# EAGLE design SparkFun_MicroMod_Input_and_Display_Carrier (EAGLE 9.6.2)

## Sheet 1 of 2
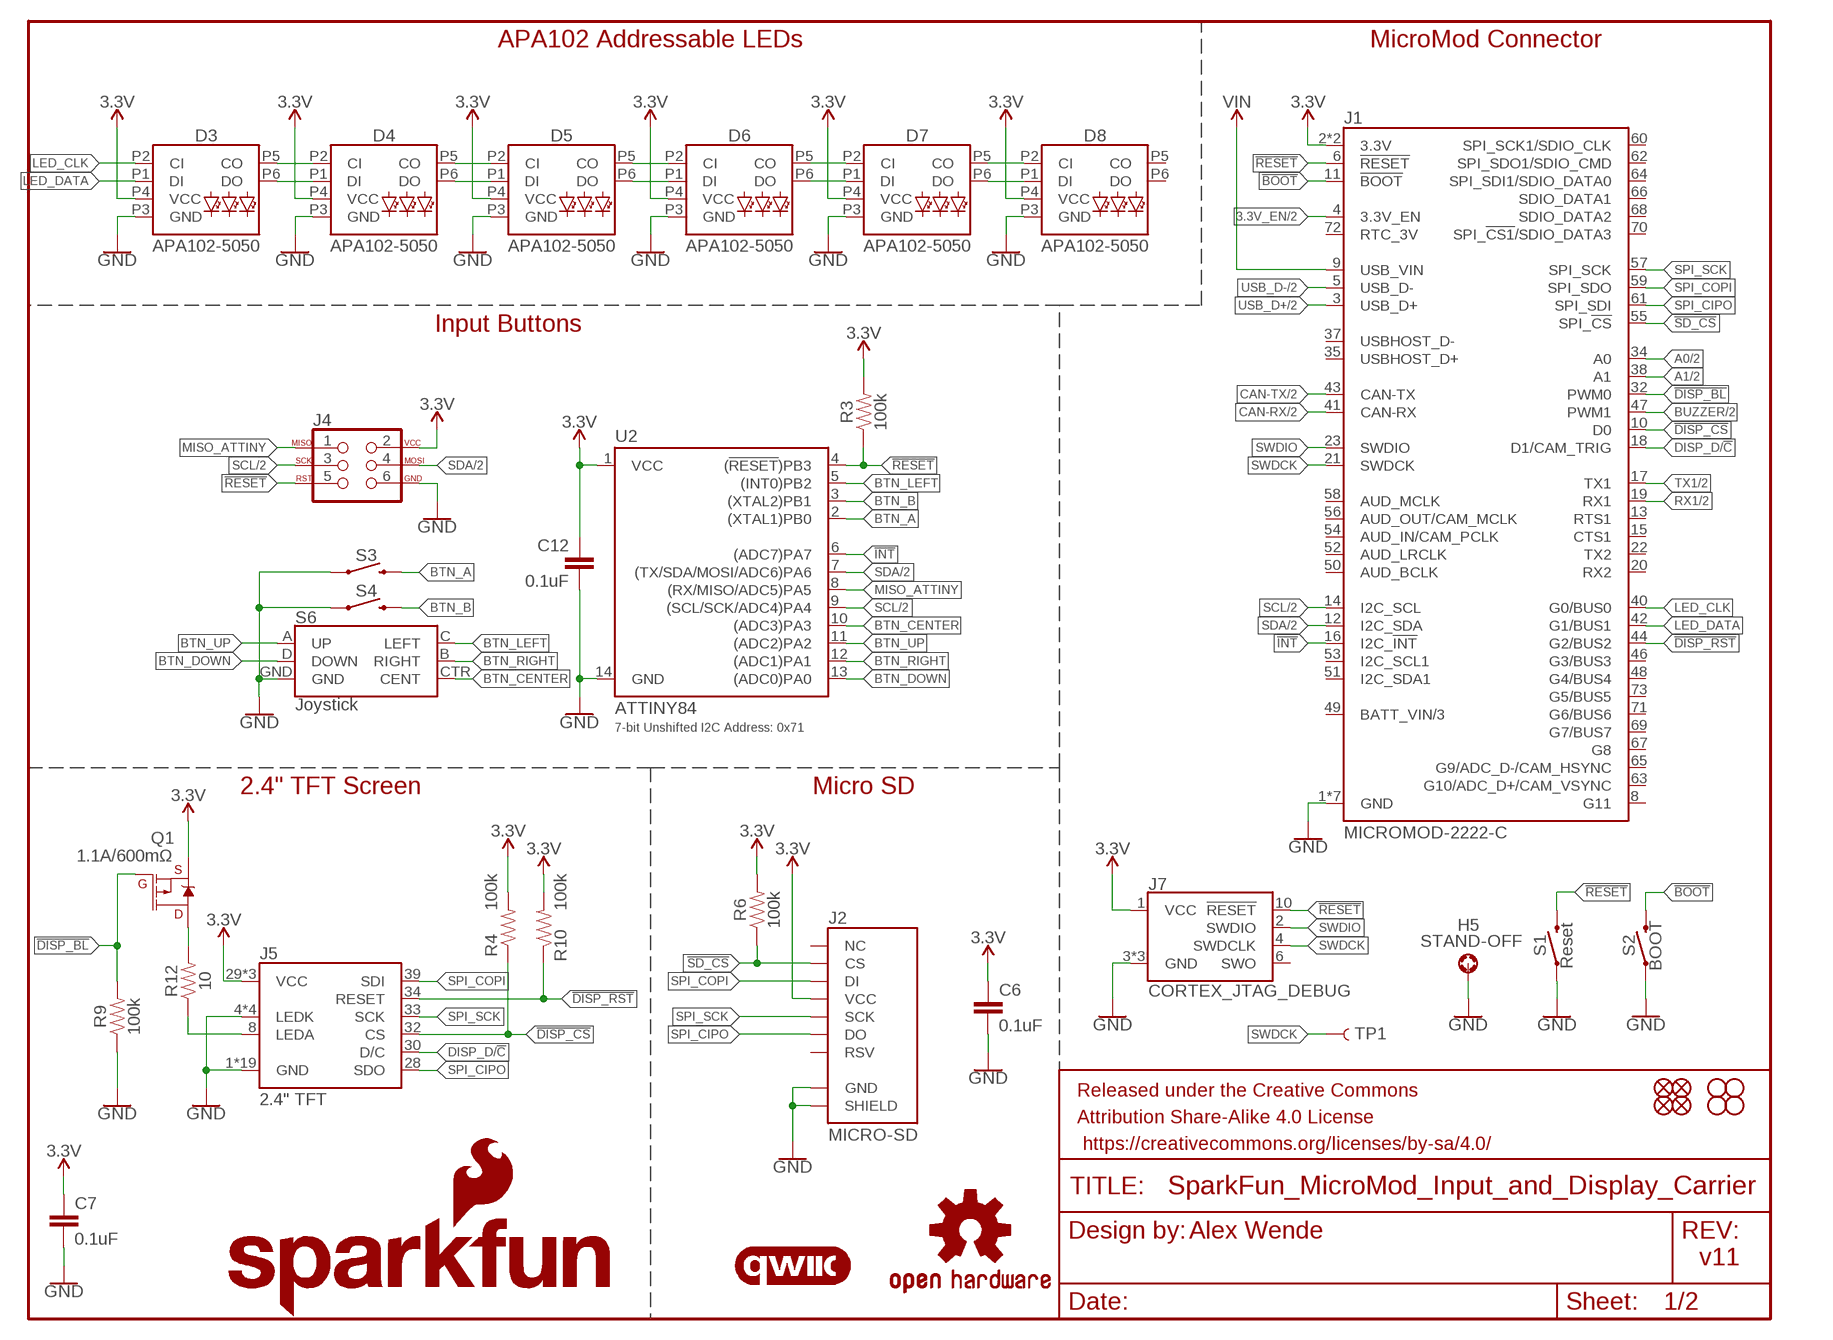
[diagram p0: schematic, sheet 1]

### Parts
C6  0.1uF  0.1UF-0603-25V-(+80/-20%)  [0603]
C7  0.1uF  0.1UF-0603-25V-(+80/-20%)  [0603]
C12  0.1uF  0.1UF-0603-25V-(+80/-20%)  [0603]
D3  APA102-5050  [APA102-5050]
D4  APA102-5050  [APA102-5050]
D5  APA102-5050  [APA102-5050]
D6  APA102-5050  [APA102-5050]
D7  APA102-5050  [APA102-5050]
D8  APA102-5050  [APA102-5050]
FD1  FIDUCIALUFIDUCIAL  [FIDUCIAL-MICRO]
FD2  FIDUCIALUFIDUCIAL  [FIDUCIAL-MICRO]
FD3  FIDUCIALUFIDUCIAL  [FIDUCIAL-MICRO]
FD4  FIDUCIALUFIDUCIAL  [FIDUCIAL-MICRO]
FRAME1  FRAME-LETTER  [CREATIVE_COMMONS]
H1  STAND-OFF  [STAND-OFF]
H2  STAND-OFF  [STAND-OFF]
H3  STAND-OFF  [STAND-OFF]
H4  STAND-OFF  [STAND-OFF]
H5  STAND-OFF  STAND-OFF-REFLOW2.5MM_TALL  [STAND-OFF-REFLOW-M2.5]
J1  MICROMOD-2222-C  [M.2-CONNECTOR-E]
J2  MICRO-SD  MICRO-SD-SPIPUSH-PUSH  [MICRO-SD-SOCKET]
J4  AVR_SPI_PROG_3X2TESTPOINTS  [2X3_TEST_POINTS]
J5  2.4" TFT  4DLCD-24-320X240  [FPC05040-17204]
J7  CORTEX_JTAG_DEBUG  CORTEX_JTAG_DEBUG_MINIMUM_PTH_NS  [2X5-PTH-1.27MM-NO_SILK]
LOGO1  SFE_LOGO_NAME_FLAME.2_INCH  [SFE_LOGO_NAME_FLAME_.2]
LOGO2  QWIIC_LOGO_5MM  [QWIIC_5MM]
LOGO3  OSHW-LOGOS  [OSHW-LOGO-S]
Q1  1.1A/600mΩ  MOSFET_PCH-SI2309DS  [SOT23-3]
R3  100k  100KOHM-0603-1/10W-1%  [0603]
R4  100k  100KOHM-0603-1/10W-1%  [0603]
R6  100k  100KOHM-0603-1/10W-1%  [0603]
R9  100k  100KOHM-0603-1/10W-1%  [0603]
R10  100k  100KOHM-0603-1/10W-1%  [0603]
R12  10  10OHM-1206-1/4W-1%  [1206]
S1  Reset  MOMENTARY-SWITCH-SPST-SMD-5.2-TALL-REDUNDANT  [TACTILE_SWITCH_SMD_5.2MM]
S2  BOOT  MOMENTARY-SWITCH-SPST-SMD-5.2-TALL-REDUNDANT  [TACTILE_SWITCH_SMD_5.2MM]
S3  MOMENTARY-SWITCH-SPST-SMD-5.2MM-TALL  [TACTILE_SWITCH_SMD_5.2MM]
S4  MOMENTARY-SWITCH-SPST-SMD-5.2MM-TALL  [TACTILE_SWITCH_SMD_5.2MM]
S6  Joystick  JOYSTICK_MINI  [JOYSTICK_MINI]
TP1  TEST-POINT3  [PAD.03X.03]
U2  ATTINY84  [SO14]

### Nets
3.3V: C6.1 C7.1 C12.1 D3.P4(VCC) D4.P4(VCC) D5.P4(VCC) D6.P4(VCC) D7.P4(VCC) D8.P4(VCC) J1.2(3.3V) J1.74(3.3V) J2.VCC J4.2 J5.29(VCC) J5.31(VCC) J5.38(VCC) J7.1(VCC) Q1.2(S) R3.2 R4.2 R6.2 R10.2 U2.1(VCC) ; also sheet 2
3.3V_EN: J1.4(3.3V_EN) ; also sheet 2
!BOOT: J1.11(!BOOT!) S2.3 S2.4
!DISP_BL: J1.32(PWM0) Q1.1(G) R9.2
!DISP_CS: J1.10(D0) J5.32(CS) R4.1
!DISP_RST: J1.44(G2/BUS2) J5.34(RESET) R10.1
!INT: J1.16(I2C_!INT!) U2.6((ADC7)PA7)
!RESET: J1.6(!RESET!) J4.5 J7.10(!RESET) R3.1 S1.3 S1.4 U2.4((!RESET!)PB3)
!SD_CS: J1.55(SPI_!CS!) J2.CS R6.1
A0: J1.34(A0) ; also sheet 2
A1: J1.38(A1) ; also sheet 2
BTN_A: S3.3 U2.2((XTAL1)PB0)
BTN_B: S4.3 U2.3((XTAL2)PB1)
BTN_CENTER: S6.CTR(CENT) U2.10((ADC3)PA3)
BTN_DOWN: S6.D(DOWN) U2.13((ADC0)PA0)
BTN_LEFT: S6.C(LEFT) U2.5((INT0)PB2)
BTN_RIGHT: S6.B(RIGHT) U2.12((ADC1)PA1)
BTN_UP: S6.A(UP) U2.11((ADC2)PA2)
BUZZER: J1.47(PWM1) ; also sheet 2
CAN-RX: J1.41(CAN-RX) ; also sheet 2
CAN-TX: J1.43(CAN-TX) ; also sheet 2
DISP_D/!C: J1.18(D1/CAM_TRIG) J5.30(D/C)
GND: C6.2 C7.2 C12.2 D3.P3(GND) D4.P3(GND) D5.P3(GND) D6.P3(GND) D7.P3(GND) D8.P3(GND) H5.1 J1.1(GND) J1.7(GND) J1.33(GND) J1.36(GND) J1.39(GND) J1.45(GND) J1.75(GND) J2.CD1(SHIELD) J2.GND J4.6 J5.1(GND) J5.4(LEDK) J5.5(LEDK) J5.6(LEDK) J5.7(LEDK) J5.11(GND) J5.12(GND) J5.13(GND) J5.14(GND) J5.15(GND) J5.16(GND) J5.17(GND) J5.18(GND) J5.19(GND) J5.20(GND) J5.21(GND) J5.22(GND) J5.23(GND) J5.24(GND) J5.25(GND) J5.26(GND) J5.27(GND) J5.40(GND) J7.3(GND) J7.5(GND) J7.9(GND) R9.1 S1.1 S1.2 S2.1 S2.2 S3.1 S4.1 S6.GND U2.14(GND) ; also sheet 2
LED_CLK: D3.P2(CI) J1.40(G0/BUS0)
LED_DATA: D3.P1(DI) J1.42(G1/BUS1)
MISO_ATTINY: J4.1 U2.8((RX/MISO/ADC5)PA5)
N$3: J5.8(LEDA) R12.1
N$4: Q1.3(D) R12.2
N$11: D3.P5(CO) D4.P2(CI)
N$14: D3.P6(DO) D4.P1(DI)
N$24: D4.P5(CO) D5.P2(CI)
N$25: D4.P6(DO) D5.P1(DI)
N$26: D5.P5(CO) D6.P2(CI)
N$27: D5.P6(DO) D6.P1(DI)
N$28: D6.P5(CO) D7.P2(CI)
N$29: D6.P6(DO) D7.P1(DI)
N$30: D7.P5(CO) D8.P2(CI)
N$31: D7.P6(DO) D8.P1(DI)
RX1: J1.19(RX1) ; also sheet 2
SCL: J1.14(I2C_SCL) J4.3 U2.9((SCL/SCK/ADC4)PA4) ; also sheet 2
SDA: J1.12(I2C_SDA) J4.4 U2.7((TX/SDA/MOSI/ADC6)PA6) ; also sheet 2
SPI_CIPO: J1.61(SPI_SDI) J2.DO J5.28(SDO)
SPI_COPI: J1.59(SPI_SDO) J2.DI J5.39(SDI)
SPI_SCK: J1.57(SPI_SCK) J2.SCLK(SCK) J5.33(SCK)
SWDCK: J1.21(SWDCK) J7.4(SWDCLK) TP1.P$1
SWDIO: J1.23(SWDIO) J7.2(SWDIO)
TX1: J1.17(TX1) ; also sheet 2
USB_D+: J1.3(USB_D+) ; also sheet 2
USB_D-: J1.5(USB_D-) ; also sheet 2
VIN: J1.9(USB_VIN) ; also sheet 2
Unconnected: D8.P5(CO) D8.P6(DO) J1.8(G11) J1.13(RTS1) J1.15(CTS1) J1.20(RX2) J1.22(TX2) J1.35(USBHOST_D+) J1.37(USBHOST_D-) J1.46(G3/BUS3) J1.48(G4/BUS4) J1.49(BATT_VIN/3) J1.50(AUD_BCLK) J1.51(I2C_SDA1) J1.52(AUD_LRCLK) J1.53(I2C_SCL1) J1.54(AUD_IN/CAM_PCLK) J1.56(AUD_OUT/CAM_MCLK) J1.58(AUD_MCLK) J1.60(SPI_SCK1/SDIO_CLK) J1.62(SPI_SDO1/SDIO_CMD) J1.63(G10/ADC_D+/CAM_VSYNC) J1.64(SPI_SDI1/SDIO_DATA0) J1.65(G9/ADC_D-/CAM_HSYNC) J1.66(SDIO_DATA1) J1.67(G8) J1.68(SDIO_DATA2) J1.69(G7/BUS7) J1.70(SPI_!CS1!/SDIO_DATA3) J1.71(G6/BUS6) J1.72(RTC_3V) J1.73(G5/BUS5) J2.RSV1(RSV) J2.RSV2(NC) J7.6(SWO)

### Notes on the sheet
- APA102 Addressable LEDs | MicroMod Connector
- Input Buttons
- 7-bit Unshifted I2C Address: 0x71
- 2.4" TFT Screen | Micro SD
- Alex Wende
- v11

## Sheet 2 of 2
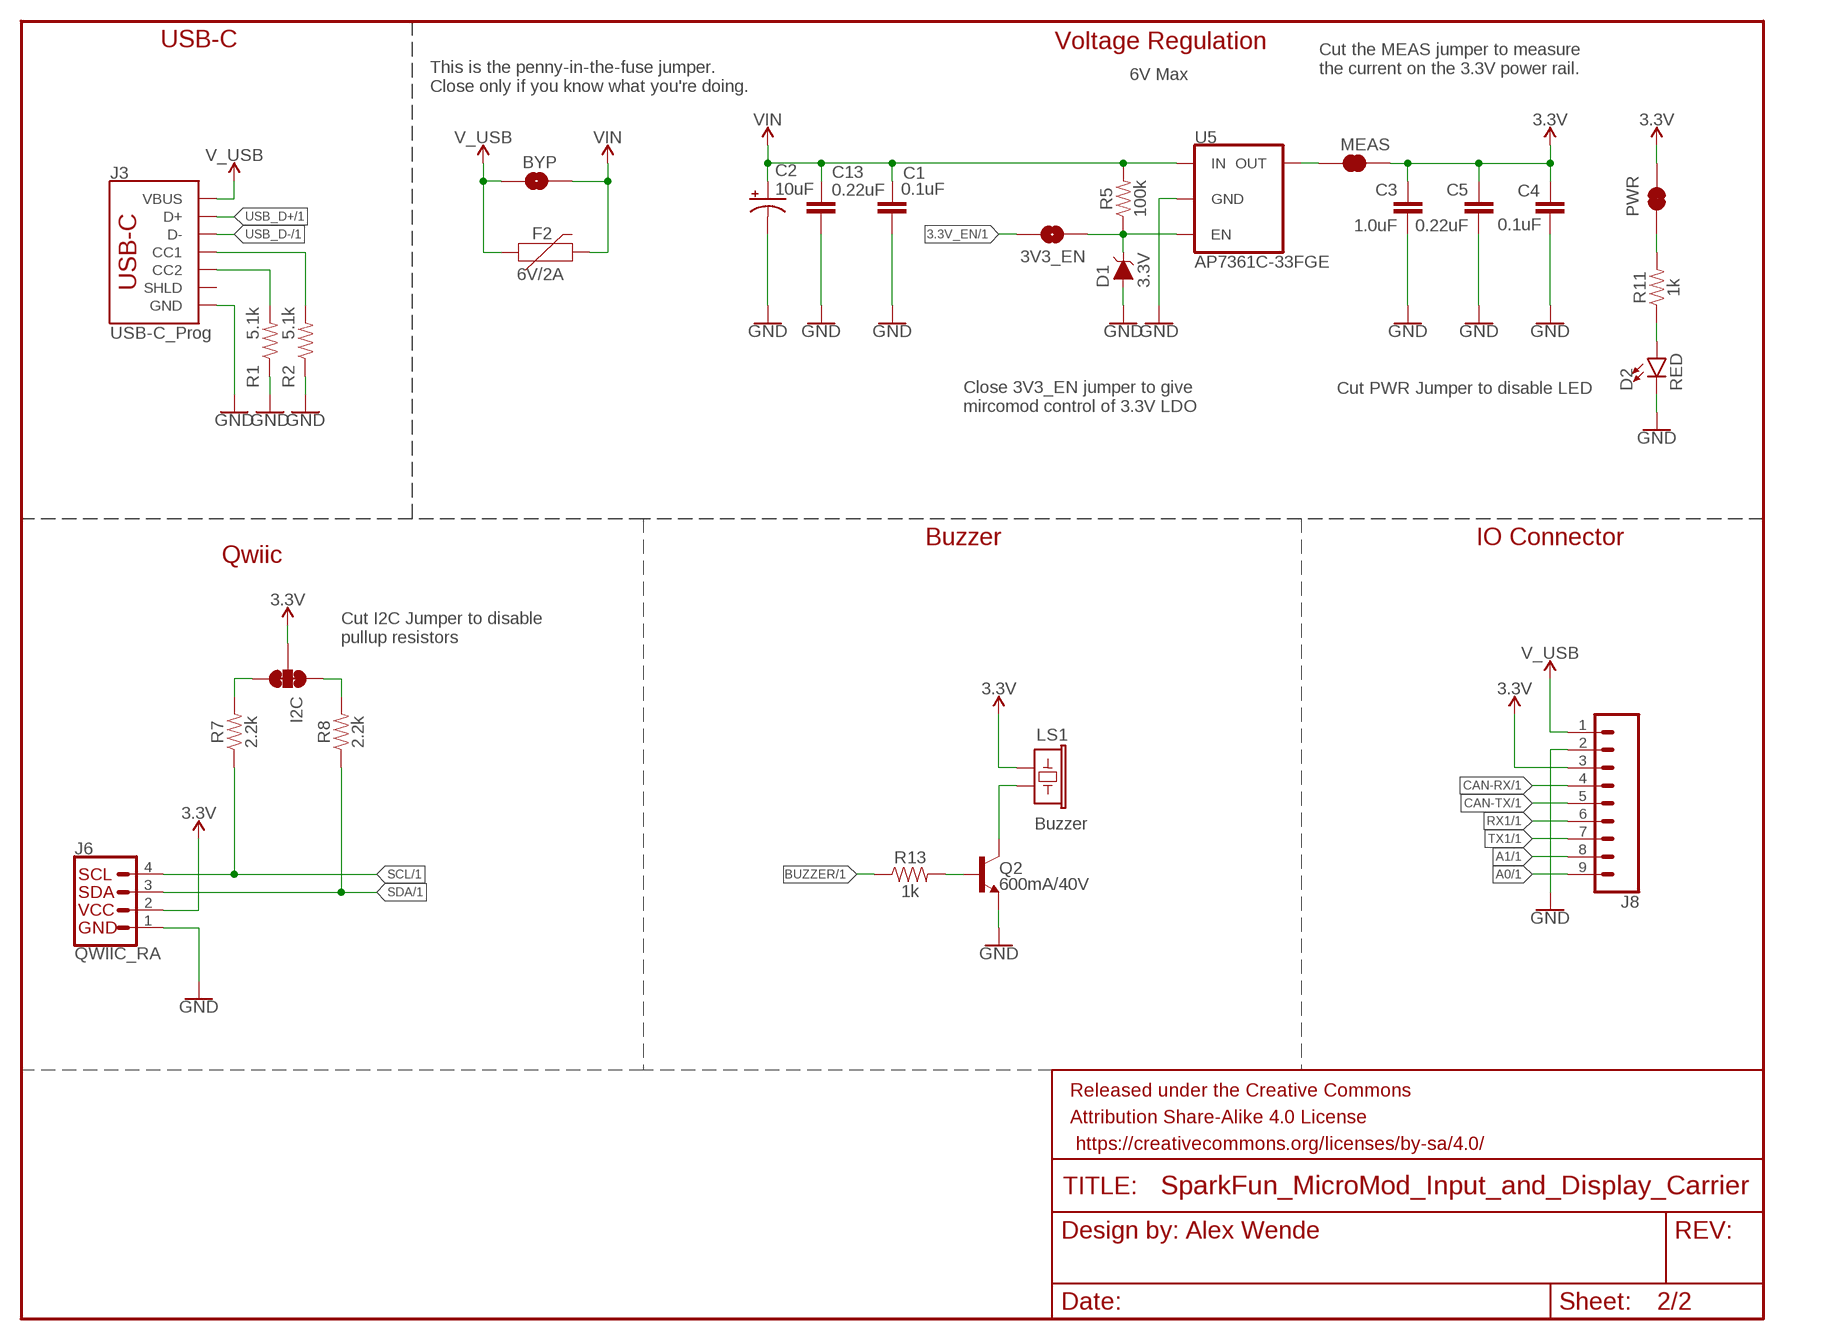
[diagram p1: schematic, sheet 2]

### Parts
3V3_EN  JUMPER-SMT_2_NO_SILK  [SMT-JUMPER_2_NO_SILK]
BYP  JUMPER-SMT_2_NO_SILK  [SMT-JUMPER_2_NO_SILK]
C1  0.1uF  0.1UF-0603-25V-(+80/-20%)  [0603]
C2  10uF  10UF-POLAR-EIA3216-16V-10%(TANT)  [EIA3216]
C3  1.0uF  1.0UF-0603-16V-10%  [0603]
C4  0.1uF  0.1UF-0603-25V-(+80/-20%)  [0603]
C5  0.22uF  0.22UF-0603-25V-10%  [0603]
C13  0.22uF  0.22UF-0603-25V-10%  [0603]
D1  3.3V  DIODE-ZENER-MM3Z3V3T1G  [SOD-323]
D2  RED  LED-RED0603  [LED-0603]
F2  6V/2A  PPTC_6V2A  [1210]
FRAME2  FRAME-LETTERNO_PACKAGE  [DUMMY]
I2C  JUMPER-SMT_3_2-NC_TRACE_SILK  [SMT-JUMPER_3_2-NC_TRACE_SILK]
J3  USB-C_Prog  USB_C_2-LAYER_PADS  [USB-C-16P-2LAYER-PADS]
J6  QWIIC_RA  QWIIC_CONNECTORJS-1MM  [JST04_1MM_RA]
J8  CONN_09NO_SILK  [1X09_NO_SILK]
LS1  Buzzer  BUZZER-SMD  [BUZZER-CCV]
MEAS  JUMPER-COMBO_2_NC_TRACE  [COMBO-JUMPER_2_NC_TRACE]
PWR  JUMPER-SMT_2_NC_TRACE_SILK  [SMT-JUMPER_2_NC_TRACE_SILK]
Q2  600mA/40V  TRANS_NPN-MMBT2222AL  [SOT23-3]
R1  5.1k  5.1KOHM5.1KOHM-0603-1/10W-1%  [0603]
R2  5.1k  5.1KOHM5.1KOHM-0603-1/10W-1%  [0603]
R5  100k  100KOHM-0603-1/10W-1%  [0603]
R7  2.2k  2.2KOHM-0603-1/10W-1%  [0603]
R8  2.2k  2.2KOHM-0603-1/10W-1%  [0603]
R11  1k  1KOHM-0603-1/10W-1%  [0603]
R13  1k  1KOHM-0603-1/10W-1%  [0603]
U5  AP7361C-33FGE  AP7361C-33FGEUDFN-8  [UDFN-8]

### Nets
3.3V: C3.1 C4.1 C5.1 I2C.2 J6.2 J8.3 LS1.+ MEAS.2 MEAS.4 PWR.2 ; also sheet 1
3.3V_EN: 3V3_EN.1 ; also sheet 1
A0: J8.9 ; also sheet 1
A1: J8.8 ; also sheet 1
BUZZER: R13.1 ; also sheet 1
CAN-RX: J8.4 ; also sheet 1
CAN-TX: J8.5 ; also sheet 1
ENABLE: 3V3_EN.2 D1.C R5.1 U5.5(EN)
GND: C1.2 C2.- C3.2 C4.2 C5.2 C13.2 D1.A D2.C J3.GND J3.GND2(GND) J6.1 J8.2 Q2.2(E) R1.1 R2.1 U5.4(GND) U5.EP(GND) ; also sheet 1
N$1: I2C.3 R7.2
N$2: I2C.1 R8.2
N$5: LS1.- Q2.3(C)
N$6: Q2.1(B) R13.2
N$19: J3.A5(CC1) R2.2
N$20: J3.B5(CC2) R1.2
N$21: PWR.1 R11.2
N$22: D2.A R11.1
N$23: MEAS.1 MEAS.3 U5.1(OUT)
RX1: J8.6 ; also sheet 1
SCL: J6.4 R7.1 ; also sheet 1
SDA: J6.3 R8.1 ; also sheet 1
TX1: J8.7 ; also sheet 1
USB_D+: J3.A6(D+) J3.B6(D+) ; also sheet 1
USB_D-: J3.A7(D-) J3.B7(D-) ; also sheet 1
V_USB: BYP.1 F2.1 J3.VBUS1(VBUS) J3.VBUS2(VBUS) J8.1
VIN: BYP.2 C1.1 C2.+ C13.1 F2.2 R5.2 U5.8(IN) ; also sheet 1
Unconnected: J3.SHLD1(SHLD) J3.SHLD2(SHLD) J3.SHLD3(SHLD) J3.SHLD4(SHLD)

### Notes on the sheet
- USB-C | Voltage Regulation
- 6V Max
- Cut the MEAS jumper to measure
  the current on the 3.3V power rail.
- This is the penny-in-the-fuse jumper.
  Close only if you know what you're doing.
- Cut PWR Jumper to disable LED
- Close 3V3_EN jumper to give
  mircomod control of 3.3V LDO
- Buzzer | IO Connector
- Qwiic
- Cut I2C Jumper to disable
  pullup resistors
- Alex Wende

## Library data of the parts
3V3_EN BYP = SparkFun-Jumpers:JUMPER-SMT_2_NO: Normally open jumper This jumper has two pads in close proximity to each other. Apply solder to close the connection. Round pads are easier to solder for beginners, but are a lot larger. SparkFun Product that uses the round pads: SparkFun EL Sequencer <https://www.sparkfun.com/products/12781>
C1 C4 C6 C7 C12 = SparkFun-Capacitors:0.1UF: 0.1µF ceramic capacitors A capacitor is a passive two-terminal electrical component used to store electrical energy temporarily in an electric field.; PROD_ID: CAP-00810
C2 = SparkFun-Capacitors:10UF-POLAR: 10.0µF polarized capacitors A capacitor is a passive two-terminal electrical component used to store electrical energy temporarily in an electric field.; PROD_ID: CAP-00811
C3 = SparkFun-Capacitors:1.0UF: 1µF ceramic capacitors A capacitor is a passive two-terminal electrical component used to store electrical energy temporarily in an electric field.; PROD_ID: CAP-00868
C5 C13 = SparkFun-Capacitors:0.22UF: 0.22µF ceramic capacitors A capacitor is a passive two-terminal electrical component used to store electrical energy temporarily in an electric field.; PROD_ID: CAP-07822
D1 = SparkFun-DiscreteSemi:DIODE-ZENER: Zener Diode A Zener diode allows current to flow from its anode to its cathode like a normal semiconductor diode, but it also permits current to flow in the reverse direction when its "Zener voltage" is reached. - WIkipedia; PROD_ID: DIO-11284
D2 = SparkFun-LED:LED-RED: Red SMD LED Used in manufacturing of most products at SparkFun Packages: 0603 - SMD 0603 package [Product Link] <http://docs.avagotech.com/docs/AV02-0551EN> 0603 SMART - SMD 0603 SMART package ( more efficient and expensive)[Product Link] <http://www.osram-os.com/Graphics/XPic2/00077099_0.pdf> 1206 - SMD1206 package [Product Link] <https://www.sparkfun.com/datasheets/DevTools/LilyPad/Q150OVS4.pdff> SparkFun Products: Pro Mini 328 -5V <https://www.sparkfun.com/products/821> RedBoard <https://www.sparkfun.com/products/12757> IOIO-OTG <https://www.sparkfun.com/products/13613>; PROD_ID: DIO-00819
D3-D8 = SparkFun-LED:APA102: APA102 Addressable RGB LED Used in manufacturing of various products at SparkFun Packages: 5050 2020 SparkFun Products: SparkFun Lumenati Boards <https://www.sparkfun.com/categories/405>; PROD_ID: DIO-13739
F2 = SparkFun-Fuses:PPTC: Resettable Fuse PPTC Resettable Fuse. Really a sort of resistor with a polymeric positive temperature coefficient whose resistance increases dramatically with an increase in temperature. When heated by the power passing through the resistance rises causing the current to be limited, protecting the circuit. This is achieved by the transition of the polymer from a crystalline to an amorphous state where the conductive carbon separates breaking the conductive pathways found in the cool crystalline structure. When a PPTC cools back down it resumes conducting letting the circuit turn back on. SparkFun Products: SparkFun RedBoard - Programmed with Arduino <https://www.sparkfun.com/products/12757> Pro Micro - 5V/16MHz <https://www.sparkfun.com/products/12640> Arduino Pro 328 - 5V/16MHz <https://www.sparkfun.com/products/10915> MP3 Trigger <https://www.sparkfun.com/products/13720>; PROD_ID: RES-14313
FD1-FD4 = SparkFun-Aesthetics:FIDUCIAL: Fiducial Alignment Points Point-of-reference for pick-and-place machines and other optical instruments.
FRAME1 = SparkFun-Aesthetics:FRAME-LETTER: Schematic Frame - Letter Standard 8.5x11 US Letter frame
FRAME2 = SparkFun-Aesthetics:FRAME-LETTER: Schematic Frame - Letter Standard 8.5x11 US Letter frame; DESIGNER: Nobody; VERSION: v01
H1-H4 = SparkFun-Hardware:STAND-OFF: Stand Off Drill holes for mechanically mounting via screws, standoffs, etc. Note: Use the keepout ring to avoid running the screw head into surrounding components. Variant Overviews STAND-OFF - Mechanical footprint for a #4 phillips button head screw. STAND-OFF-TIGHT - Mechanical footprint for a #4 phillips button head screw, Example SparkFun Products Screw - Phillips Head (1/4", 4-40, 10 pack) <https://www.sparkfun.com/products/10453> (PRT-10453) Screw - Phillips Head (1/2", 4-40, 10 pack) <https://www.sparkfun.com/products/10452> (PRT-10452) Screw - Phillips Head (3/4", 4-40, 10 pack) <https://www.sparkfun.com/products/10451> (PRT-10451) Screw - Phillips Head (1", 4-40, 10 pack) <https://www.sparkfun.com/products/10450> (PRT-10450)
H5 = SparkFun-Hardware:STAND-OFF-REFLOW: Stand Off Reflow Compatible A metal standoff that can be placed and reflowed onto a PCB.; PROD_ID: HW-14899
I2C = SparkFun-Jumpers:JUMPER-SMT_3_2-NC_TRACE: Normally closed trace jumper (2 of 2 connections) This jumper has a trace between all three pads so they are normally closed (NC). Use a razor knife to open the connection(s). For best results follow the IPC guidelines for cutting traces: Cutout at least 0.063 mm (0.005 in). Remove all loose material to clean up the cut area. Seal the cut with an approved epoxy. Reapply solder to reclose the connection(s).
J1 = SparkFun-MicroMod:MICROMOD: MicroMod Connector Description: A card edge connector and mating PCB connector to allow various MicroMod Processor Boards to be coupled with various carrier boards of different capabilities. Based on the M.2 standard.; PROD_ID: CONN-14877; SPICEPREFIX: X
J2 = SparkFun-Connectors:MICRO-SD-SPI: microSD Socket for Transflash Push-push type µSD socket. tDoc lines correctly indicate media card edge positions when inserting (unlocked, locked, depressed). NOTE: CD1 and CD2 are connected internally, and the default detect state of the socket is detect pin to ground. SparkFun Products: WAV Trigger <https://www.sparkfun.com/products/13660> CAN-Bus Shield <https://www.sparkfun.com/products/13262> SparkFun Level Shifing microSD Breakout <https://www.sparkfun.com/products/13743>; PROD_ID: CONN-07820
J3 = SparkFun-Connectors:USB_C: USB Type C 16Pin Connector Super Speed pins not available on the 16-pin purely SMD connector so this part is best for USB 2.0 implementations. D1 and D2 are tied together enabling D+/- no matter which way the cable is plugged into the connector. The two channel configuration pins (CC1/2) are exposed. These are normally connected to ground via 5.1k resistors but can be reconfigured for high current/high power applications.; PROD_ID: CONN-14122
J4 = SparkFun-Connectors:AVR_SPI_PROG_3X2: AVR ISP 6 Pin This is the reduced ISP connector for AVR programming. Common on Arduino. This footprint will take up less PCB space and can be used with a 10-pin to 6-pin adapter such as SKU: BOB-08508 **Special note about "TEST_POINT" package. The stop mask is on the top side, so if you want your programming test points to be on the bottom of your board, make sure to place this package on the bottom side of the board. This also ensure that the orientation to program from the bottom side will be correct. SparkFun Products: SparkFun ISP Pogo Adapter <https://www.sparkfun.com/products/11591> - NS Tiny AVR Programmer <https://www.sparkfun.com/products/11801> -PTH
J5 = SparkFun-Displays:4DLCD-24-320X240: 4D LCD 4DLCD-24320240-IPS - 2.4" 240x320 TFT LCD 4-wire SPI capable TFT display. 36.72 x 48.96mm active area; PROD_ID: LCD-14913; PROD_ID1: CONN-14082
J6 = SparkFun-Connectors:QWIIC_CONNECTOR: SparkFun I2C Standard Qwiic Connector An SMD 1mm pitch JST connector makes it easy and quick (get it? Qwiic?) to connect I2C devices to each other. The Qwiic system <http://www.sparkfun.com/qwiic> enables fast and solderless connection between popular platforms and various sensors and actuators. We carry 200mm <https://www.sparkfun.com/products/14204>, 100mm <https://www.sparkfun.com/products/14205>, 50mm <https://www.sparkfun.com/products/14206>, and breadboard friendly <https://www.sparkfun.com/products/14207> Qwiic cables. We also offer 10 pcs strips <https://www.sparkfun.com/products/14323> the SMD connectors.; PROD_ID: CONN-13694; VALUE: QWIIC_RIGHT_ANGLE
J7 = SparkFun-Connectors:CORTEX_JTAG_DEBUG_MINIMUM: Cortex Debug Connector - 10 pin Supports JTAG debug, Serial Wire debug, and Serial Wire Viewer. PTH and SMD connector options available. General Connector Information <http://infocenter.arm.com/help/topic/com.arm.doc.faqs/attached/13634/cortex_debug_connectors.pdf> Products: PTH Connector <http://www.digikey.com/product-detail/en/cnc-tech/3220-10-0100-00/1175-1627-ND/3883661> -via Digi-Key SparkFun PSoc <https://www.sparkfun.com/products/13229> SparkFun T <https://www.sparkfun.com/products/13810>
J8 = SparkFun-Connectors:CONN_09: Multi connection point. Often used as Generic Header-pin footprint for 0.1 inch spaced/style header connections On any of the 0.1 inch spaced packages, you can populate with these: Break Away Headers - Straight <https://www.sparkfun.com/products/116> (PRT-00116) Break Away Male Headers - Right Angle <https://www.sparkfun.com/products/553> (PRT-00553) Female Headers <https://www.sparkfun.com/products/115> (PRT-00115) Break Away Headers - Machine Pin <https://www.sparkfun.com/products/117> (PRT-00117) Break Away Female Headers - Swiss Machine Pin <https://www.sparkfun.com/products/743> (PRT-00743) For SCREWTERMINALS and SPRING TERMINALS visit here: Screw Terimnals on SparkFun.com <https://www.sparkfun.com/search/results?term=Screw+Terminals> (5mm/3.5mm/2.54mm spacing) This device is also useful as a general connection point to wire up your design to another part of your project. Our various solder wires solder well into these plated through hole pads. Hook-Up Wire - Assortment (Stranded, 22 AWG) <https://www.sparkfun.com/products/11375> (PRT-11375) Hook-Up Wire - Assortment (Solid Core, 22 AWG) <https://www.sparkfun.com/products/11367> (PRT-11367) View the entire wire category on our website here <https://www.sparkfun.com/categories/141> Special notes: Molex polarized connector foot print use with SKU : PRT-08231 with associated crimp pins and housings. 1MM SMD Version SKU: PRT-10208 NOTES ON THE VARIANTS LOCK and LOCK_LONGPADS... This footprint was designed to help hold the alignment of a through-hole component (i.e. 6-pin header) while soldering it into place. You may notice that each hole has been shifted either up or down by 0.005 of an inch from it's more standard position (which is a perfectly straight line). This slight alteration caused the pins (the squares in the middle) to touch the edges of the holes. Because they are alternating, it causes a "brace" to hold the component in place. 0.005 has proven to be the perfect amount of "off-center" position when using our standard breakaway headers. Although looks a little odd when you look at the bare footprint, once you have a header in there, the alteration is very hard to notice. Also,if you push a header all the way into place, it is covered up entirely on the bottom side.
LOGO1 = SparkFun-Aesthetics:SFE_LOGO_NAME_FLAME: SparkFun Font Logo w/ Flame This is the SparkFun full logo. The logo on the schematic will always be the same size; the package variant is the height of the flame part of the logo. Default layer for the logo on the board is tSilk.
LOGO2 = SparkFun-Aesthetics:QWIIC_LOGO: Qwiic Logos for placement on schematic and PCB. The 5.5mm silk logo is best for placing next to Qwiic connector.
LOGO3 = SparkFun-Aesthetics:OSHW-LOGO: Open-Source Hardware (OSHW) Logo This logo indicates the piece of hardware it is found on incorporates a OSHW license and/or adheres to the definition of open source hardware found here: http://freedomdefined.org/OSHW
LS1 = SparkFun-Electromechanical:BUZZER: Buzzer Small round buzzers that operate around the audible 2kHz range. You can use these as speakers to create simple music or user interfaces. Variant Overview: PTH - Mini Speaker - PC Mount 12mm 2.048kHz <https://www.sparkfun.com/products/7950> PTH_KIT - Mini Speaker - PC Mount 12mm 2.048kHz <https://www.sparkfun.com/products/7950> KIT simplifies soldering by adding stop mask to one side of the pads. PTH_NO_SILK - Mini Speaker - PC Mount 12mm 2.048kHz <https://www.sparkfun.com/products/7950> No silkscreen indicator of buzzer outline. PTH_KIT_NO_SILK - Mini Speaker - PC Mount 12mm 2.048kHz <https://www.sparkfun.com/products/7950> KIT package w/o silkscreen SMD - Buzzer Audio Magnetic (CCV-084B16) SMD buzzer used on, e.g. the LilyPad Buzzer <https://www.sparkfun.com/products/8463> and RFID USB Reader <https://www.sparkfun.com/products/9963>. SMD_KIT - Buzzer Audio Magnetic (CCV-084B16) SMD Buzzer with elongated pins to make soldering easier. Used on the SparkFun Simon Says - Surface Mount Soldering Kit <https://www.sparkfun.com/products/10935>.; PROD_ID: COMP-08568
MEAS = SparkFun-Jumpers:JUMPER-COMBO_2_NC_TRACE
PWR = SparkFun-Jumpers:JUMPER-SMT_2_NC_TRACE: Normally closed trace jumper This jumper has a trace between two pads so it's normally closed (NC). Use a razor knife to open the connection. For best results follow the IPC guidelines for cutting traces: Cutout at least 0.063 mm (0.005 in). Remove all loose material to clean up the cut area. Seal the cut with an approved epoxy. Reapply solder to reclose the connection.
Q1 = SparkFun-DiscreteSemi:MOSFET_PCH: P-channel MOSFETs Voltage controlled devices that allow control of high current outputs. SparkFun Products: SparkFun ESP32 Thing <https://www.sparkfun.com/products/13907> SparkFun ESP8266 Thing <https://www.sparkfun.com/products/13231> SparkFun Pi Servo HAT V2 <https://www.sparkfun.com/products/15316> DMG2305UX-7 (20V/4.2A/SOT23-3); PROD_ID: TRANS-08285; VALUE: 1.1A/60V/600mΩ
Q2 = SparkFun-DiscreteSemi:TRANS_NPN: NPN transistor Current controlled devices typically used to amplify current or used as a switch. BC547 - COM-08928 <http://www.sparkfun.com/products/8928> (TO-92 45V 100mA) (1.Collector 2.Base 3.Emitter) 2N3904 - COM-00521 <http://www.sparkfun.com/products/521> (TO-92 40V 200mA) (1.Emitter 2.Base 3.Collector) P2N2222A - COM-12852 <http://www.sparkfun.com/products/12852> (TO-92 40V 600mA) (1.Collector 2.Base 3.Emitter); PROD_ID: TRANS-08049
R1 R2 = SparkFun-Resistors:5.1KOHM; PROD_ID: RES-12083
R3-R6 R9 R10 = SparkFun-Resistors:100KOHM: 100kΩ resistor A resistor is a passive two-terminal electrical component that implements electrical resistance as a circuit element. Resistors act to reduce current flow, and, at the same time, act to lower voltage levels within circuits. - Wikipedia; PROD_ID: RES-07828
R7 R8 = SparkFun-Resistors:2.2KOHM: 2.2kΩ resistor A resistor is a passive two-terminal electrical component that implements electrical resistance as a circuit element. Resistors act to reduce current flow, and, at the same time, act to lower voltage levels within circuits. - Wikipedia; PROD_ID: RES-08272
R11 R13 = SparkFun-Resistors:1KOHM: 1kΩ resistor A resistor is a passive two-terminal electrical component that implements electrical resistance as a circuit element. Resistors act to reduce current flow, and, at the same time, act to lower voltage levels within circuits. - Wikipedia; PROD_ID: RES-07856
R12 = SparkFun-Resistors:10OHM: 10Ω resistor A resistor is a passive two-terminal electrical component that implements electrical resistance as a circuit element. Resistors act to reduce current flow, and, at the same time, act to lower voltage levels within circuits. - Wikipedia; PROD_ID: RES-08705
S1-S4 = SparkFun-Switches:MOMENTARY-SWITCH-SPST: Momentary Switch (Pushbutton) - SPST Normally-open (NO) SPST momentary switches (buttons, pushbuttons). Variants PTH-12MM - 12mm square, through-hole Momentary Pushbutton Switch - 12mm Square <https://www.sparkfun.com/products/9190> (COM-09190) PTH-6.0MM, PTH-6.0MM-KIT - 6.0mm square, through-hole Mini Pushbutton Switch <https://www.sparkfun.com/products/97> (COM-00097) KIT package intended for soldering kit's - only one side of pads' copper is exposed. PTH-RIGHT-ANGLE-KIT - Right-angle, through-hole Right Angle Tactile Button <https://www.sparkfun.com/products/10791> - Used on SparkFun BigTime Watch Kit <https://www.sparkfun.com/products/11734> SMD-12MM - 12mm square, surface-mount Tactile Button - SMD (12mm) <https://www.sparkfun.com/products/12993> (COM-12993) Used on SparkFun PicoBoard <https://www.sparkfun.com/products/11888> SMD-4.5MM - 4.5mm Square Trackball Switch Used on SparkFun Blackberry Trackballer Breakout <https://www.sparkfun.com/products/13169> SMD-4.6MMX2.8MM - 4.60mm x 2.80mm, surface mount Used on SparkFun SAMD21 Mini Breakout <https://www.sparkfun.com/products/13664> SMD-5.2MM, SMD-5.2-REDUNDANT - 5.2mm square, surface-mount Mini Pushbutton Switch - SMD <https://www.sparkfun.com/products/8720> (COM-08720) Used on Arduino Pro Mini <https://www.sparkfun.com/products/11114> REDUNDANT package connects both switch circuits together SMD-6.0X3.5MM - 6.0 x 3.5mm, surface mount Momentary Reset Switch SMD <https://www.sparkfun.com/products/8229> (COM-08229) SMD-6.2MM-TALL - 6.2mm square, surface mount Tactile Button - SMD (6mm) <https://www.sparkfun.com/products/12992> Used on SparkFun Digital Sandbox <https://www.sparkfun.com/products/12651> SMD-RIGHT-ANGLE - Right-angle, surface mount Used on SparkFun Block for Intel® Edison - Arduino <https://www.sparkfun.com/products/13036>; PROD_ID: SWCH-14139
S6 = SparkFun-Switches:JOYSTICK_MINI: Small Tactile Joystick w/ Select Switch A 5-way tactile switch allows for a joystick-like interface in a very small package. Part #: 4UCON SF303GJ26 SparkFun Products 5-way Tactile Switch <https://www.sparkfun.com/products/10063> (COM-10063) Used on SparkFun Block for Intel® Edison - OLED <https://www.sparkfun.com/products/13035> (DEV-13035) Used on CAN-BUS Shield <https://www.sparkfun.com/products/13262> (DEV-13262); PROD_ID: SWCH-09905; SF_SKU: COM-10063
TP1 = SparkFun-Connectors:TEST-POINT: SparkFun Test Points Bare copper test points for troubleshooting or In-Circuit-Testing. These are used by our Production team for verifying production board runs using pogo-pins on test beds. SparkFun Products: SparkFun LSM9DS1 Breakout <https://www.sparkfun.com/products/13284> SparkFun PSOC <https://www.sparkfun.com/products/13714> SparkFun Load Cell Amplifier <https://www.sparkfun.com/products/13879>
U2 = SparkFun-IC-Microcontroller:ATTINY84: Atmel 14-pin 2/4/8kB flash uC Datasheet <https://cdn.sparkfun.com/datasheets/Widgets/doc8006.pdf> SparkFun Products Tiny AVR Programmer <https://www.sparkfun.com/products/11801> (PGM-11801) SparkFun Servo Trigger - Continuous Rotation <https://www.sparkfun.com/products/13872> (WIG-13872) SparkFun Servo Trigger <https://www.sparkfun.com/products/13118> (WIG-13118); PROD_ID: IC-11285
U5 = SparkFun-IC-Power:AP7361C-33FGE: AP7361C 3.3V LDO Regulator; PROD_ID: VREG-14094

## Board
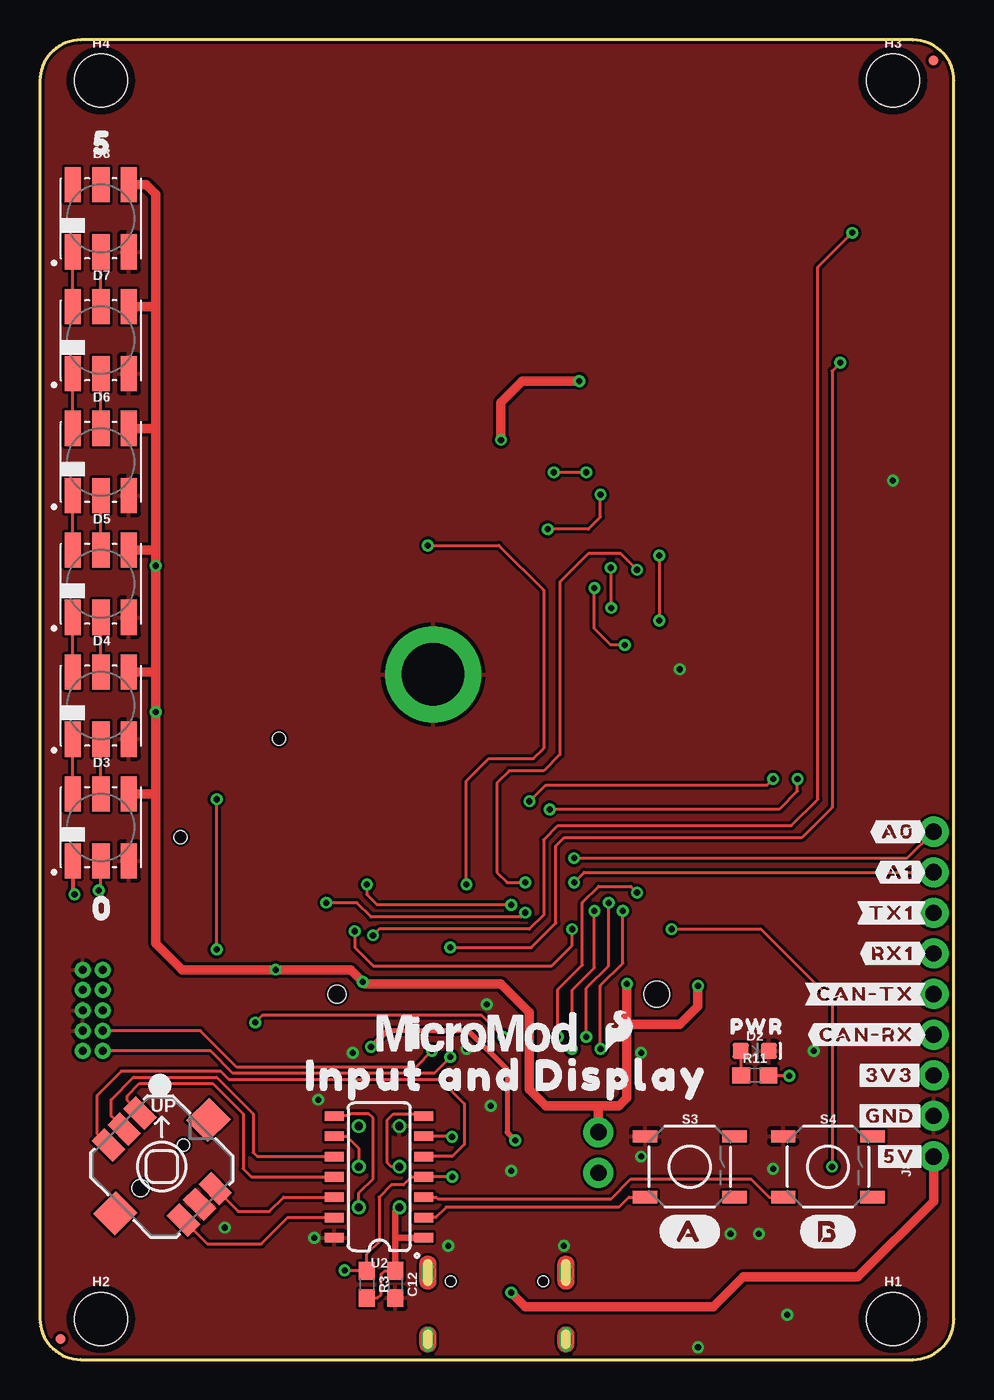
[diagram p2: board, top side]
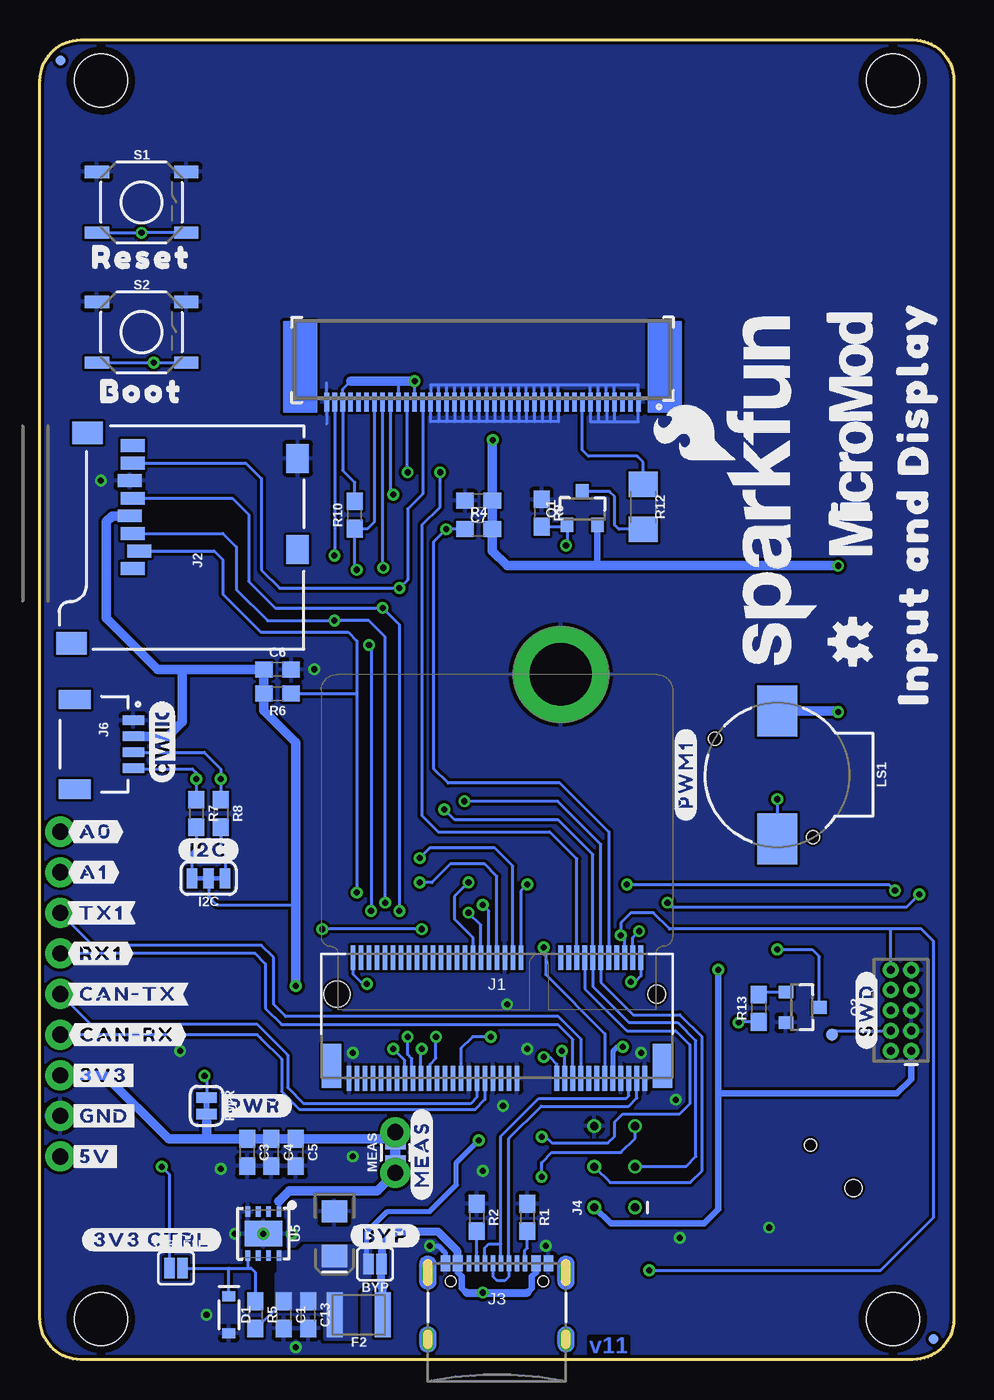
[diagram p3: board, bottom side, seen from below]

Size 57.15 x 82.55 mm. Coordinates in mm from the lower left corner, seen from the top.
Outline: 57.15,2.54 57.15,80.01 arc90 54.61,82.55 2.54,82.55 arc90 0,80.01 0,2.54 arc90 2.54,0 54.61,0 arc90 57.15,2.54
Copper layers (1*16): Top 0.035mm / dielectric 1.5mm / Bottom 0.035mm
Design rules "SparkFun-2-layer-TIGHT": minimum track width 7mil, minimum drill 15mil, track to track 7mil, track to pad 7mil, pad to pad 7mil, via to via 7mil, smd to smd 7mil, copper to edge 7mil, drill to drill 7mil, minimum pad ring 7mil, minimum via ring 7mil, stop-mask expansion 4mil, vias tented up to drill 25mil, thermal gap 10mil

### Footprints (pad centres in the part's own frame; a part is rotated, then mirrored left to right if it is on the bottom)
SMT-JUMPER_2_NO_SILK = smd 0.635 x 1.27: 1 -0.406,0; 2 0.406,0
0603 = smd 1.1 x 1: 1 -0.85,0; 2 0.85,0
EIA3216 = smd 1.4 x 1.6: + 1.4,0; - -1.4,0
SOD-323 = smd 0.63 x 0.83: A 1.15,0; C -1.15,0
LED-0603 = smd 1 x 1: A -0.877,0; C 0.877,0
APA102-5050 = smd 1 x 2.2: P1 -1.75,-2.1; P3 1.75,-2.1; P4 1.75,2.1; P6 -1.75,2.1 | smd 1.1 x 2.2: P2 0,-2.1; P5 0,2.1
1210 = smd 1 x 2.8: 1 -1.5,0; 2 1.5,0
FIDUCIAL-MICRO = smd 0.635 x 0.635: 1 0,0
STAND-OFF = hole 3.302: 0,0
STAND-OFF-REFLOW-M2.5 = drill 3.9 pad 6: 1 0,0
SMT-JUMPER_3_2-NC_TRACE_SILK = smd 0.66 x 1.27: 1 -1.041,0; 2 0,0; 3 1.041,0
M.2-CONNECTOR-E = smd 0.3 x 1.55: 1 9.25,-5.275; 2 9,2.275; 3 8.75,-5.275; 4 8.5,2.275; 5 8.25,-5.275; 6 8,2.275; 7 7.75,-5.275; 8 7.5,2.275; 9 7.25,-5.275; 10 7,2.275; 11 6.75,-5.275; 12 6.5,2.275; 13 6.25,-5.275; 14 6,2.275; 15 5.75,-5.275; 16 5.5,2.275; 17 5.25,-5.275; 18 5,2.275; 19 4.75,-5.275; 20 4.5,2.275; 21 4.25,-5.275; 22 4,2.275; 23 3.75,-5.275; 32 1.5,2.275; 33 1.25,-5.275; 34 1,2.275; 35 0.75,-5.275; 36 0.5,2.275; 37 0.25,-5.275; 38 0,2.275; 39 -0.25,-5.275; 40 -0.5,2.275; 41 -0.75,-5.275; 42 -1,2.275; 43 -1.25,-5.275; 44 -1.5,2.275; 45 -1.75,-5.275; 46 -2,2.275; 47 -2.25,-5.275; 48 -2.5,2.275; 49 -2.75,-5.275; 50 -3,2.275; 51 -3.25,-5.275; 52 -3.5,2.275; 53 -3.75,-5.275; 54 -4,2.275; 55 -4.25,-5.275; 56 -4.5,2.275; 57 -4.75,-5.275; 58 -5,2.275; 59 -5.25,-5.275; 60 -5.5,2.275; 61 -5.75,-5.275; 62 -6,2.275; 63 -6.25,-5.275; 64 -6.5,2.275; 65 -6.75,-5.275; 66 -7,2.275; 67 -7.25,-5.275; 68 -7.5,2.275; 69 -7.75,-5.275; 70 -8,2.275; 71 -8.25,-5.275; 72 -8.5,2.275; 73 -8.75,-5.275; 74 -9,2.275; 75 -9.25,-5.275 | smd 1.2 x 2.75: A1 10.35,-4.5; A2 -10.35,-4.5 | hole 1.1: 10,0 | hole 1.6: -10,0
MICRO-SD-SOCKET = smd 1.8 x 1.4: CD1 -2.05,0.4; CD2 -7.75,0.4 | smd 0.8 x 1.5: CS -7.84,10.3; DI -6.74,10.7; DO -2.34,10.7; GND -3.44,10.9; RSV1 -8.94,10.7; RSV2 -1.24,10.7; SCLK -4.54,10.7; VCC -5.64,10.9 | smd 1.4 x 1.9: GND1 -13.6,14.55; GND3 -0.45,13.55
USB-C-16P-2LAYER-PADS = smd 0.3 x 1: A5 -1.25,-0.34; A6 -0.25,-0.34; A7 0.25,-0.34; A8 1.25,-0.34; B5 1.75,-0.34; B6 0.75,-0.34; B7 -0.75,-0.34; B8 -1.75,-0.34 | smd 0.6 x 1: GND -3.225,-0.34; GND2 3.225,-0.34; VBUS1 -2.45,-0.34; VBUS2 2.45,-0.34 | drill 0.4 pad 0.6 long: SHLD1 -4.318,-0.915; SHLD2 4.318,-0.915; SHLD3 -4.318,-5.095; SHLD4 4.318,-5.095 | hole 0.65: -2.89,-1.445; 2.89,-1.445
2X3_TEST_POINTS = drill 0.508: 1 -2.54,-1.27; 2 -2.54,1.27; 3 0,-1.27; 4 0,1.27; 5 2.54,-1.27; 6 2.54,1.27
FPC05040-17204 = smd 0.3 x 1.2: 1 -9.75,0.6; 2 -9.25,0.6; 3 -8.75,0.6; 4 -8.25,0.6; 5 -7.75,0.6; 6 -7.25,0.6; 7 -6.75,0.6; 8 -6.25,0.6; 9 -5.75,0.6; 10 -5.25,0.6; 11 -4.75,0.6; 12 -4.25,0.6; 13 -3.75,0.6; 14 -3.25,0.6; 15 -2.75,0.6; 16 -2.25,0.6; 17 -1.75,0.6; 18 -1.25,0.6; 19 -0.75,0.6; 20 -0.25,0.6; 21 0.25,0.6; 22 0.75,0.6; 23 1.25,0.6; 24 1.75,0.6; 25 2.25,0.6; 26 2.75,0.6; 27 3.25,0.6; 28 3.75,0.6; 29 4.25,0.6; 30 4.75,0.6; 31 5.25,0.6; 32 5.75,0.6; 33 6.25,0.6; 34 6.75,0.6; 35 7.25,0.6; 36 7.75,0.6; 37 8.25,0.6; 38 8.75,0.6; 39 9.25,0.6; 40 9.75,0.6
JST04_1MM_RA = smd 0.6 x 1.35: 1 -1.5,0; 2 -0.5,0; 3 0.5,0; 4 1.5,0 | smd 1.2 x 2: NC1 2.8,-3.675; NC2 -2.8,-3.675
2X5-PTH-1.27MM-NO_SILK = drill 0.508 pad 1: 1 -2.54,-0.635; 2 -2.54,0.635; 3 -1.27,-0.635; 4 -1.27,0.635; 5 0,-0.635; 6 0,0.635; 7 1.27,-0.635; 8 1.27,0.635; 9 2.54,-0.635; 10 2.54,0.635
1X09_NO_SILK = drill 1.016 pad 1.88: 1 0,0; 2 2.54,0; 3 5.08,0; 4 7.62,0; 5 10.16,0; 6 12.7,0; 7 15.24,0; 8 17.78,0; 9 20.32,0
BUZZER-CCV = smd 3.2 x 2.5: + 4,0; - -4,0 | hole 0.8: -3.9,-2.25; 2.25,3.9
COMBO-JUMPER_2_NC_TRACE = smd 0.635 x 1.27: 1 -0.508,0; 2 0.508,0 | drill 1.016 pad 1.88: 3 -1.27,0; 4 1.27,0
SMT-JUMPER_2_NC_TRACE_SILK = smd 0.66 x 1.27: 1 -0.521,0; 2 0.521,0
SOT23-3 = smd 0.8 x 0.9: 1 -0.95,-1; 2 0.95,-1; 3 0,1.1
1206 = smd 1.6 x 1.8: 1 -1.4,0; 2 1.4,0
TACTILE_SWITCH_SMD_5.2MM = smd 1.524 x 0.762: 1 -2.794,1.905; 2 2.794,1.905; 3 -2.794,-1.905; 4 2.794,-1.905
JOYSTICK_MINI = smd 1.85 x 1.1: A -3.325,1.4; B 3.325,1.4; C -3.325,-1.4; CTR -3.325,0; D 3.325,-1.4; GND 3.325,0 | smd 1.9 x 2: NC 0,4.13; NC@0 0,-4.13 | hole 0.75: 0,1.9 | hole 1.05: 0,-1.9
PAD.03X.03 = smd 0.762 x 0.762: P$1 0,0
SO14 = smd 0.6 x 1.2: 1 -3.81,-2.8; 2 -2.54,-2.8; 3 -1.27,-2.8; 4 0,-2.8; 5 1.27,-2.8; 6 2.54,-2.8; 7 3.81,-2.8; 8 3.81,2.8; 9 2.54,2.8; 10 1.27,2.8; 11 0,2.8; 12 -1.27,2.8; 13 -2.54,2.8; 14 -3.81,2.8
UDFN-8 = smd 0.3 x 0.65: 1 -0.975,-1.375; 2 -0.325,-1.375; 3 0.325,-1.375; 4 0.975,-1.375; 5 0.975,1.375; 6 0.325,1.375; 7 -0.325,1.375; 8 -0.975,1.375 | smd 2.35 x 1.6: EP 0,0

### Placement (x,y rotation side)
3V3_EN  48.64,5.71 0 bottom
BYP  36.2,5.97 180 bottom
C1  41.91,2.79 270 bottom
C2  38.73,7.87 270 bottom
C3  44.2,12.95 270 bottom
C4  42.67,12.95 270 bottom
C5  41.15,12.95 270 bottom
C6  42.29,43.18 0 bottom
C7  29.72,53.72 180 bottom
C12  22.23,4.7 270 top
C13  40.39,2.79 270 bottom
D1  45.34,2.79 270 bottom
D2  44.7,19.3 0 top
D3  3.81,33.29 0 top
D4  3.81,40.91 0 top
D5  3.81,48.53 0 top
D6  3.81,56.15 0 top
D7  3.81,63.77 0 top
D8  3.81,71.39 0 top
F2  37.21,2.79 180 bottom
FD1  1.27,1.27 0 bottom
FD2  1.27,1.27 0 top
FD3  55.88,81.28 0 top
FD4  55.88,81.28 0 bottom
FRAME1  5.08,-24.13 0 top  (outside the outline)
FRAME2  -15.24,-25.4 0 top  (outside the outline)
H1  53.34,2.54 0 top
H2  3.81,2.54 0 top
H3  53.34,80.01 0 top
H4  3.81,80.01 0 top
H5  24.58,42.87 90 bottom
I2C  46.61,30.1 180 bottom
J1  28.57,22.86 0 bottom
J2  40.64,58.42 90 bottom
J3  28.57,6.35 0 bottom
J4  21.21,12.06 90 bottom
J5  29.48,60.5 180 bottom
J6  51.31,38.48 270 bottom
J7  3.3,21.84 90 bottom
J8  55.88,12.7 90 top
LOGO1  11.41,54.43 90 bottom
LOGO2  49.53,38.61 90 bottom
LOGO3  6.33,44.9 90 bottom
LS1  11.05,36.58 90 bottom
MEAS  34.92,12.95 90 bottom
PWR  46.74,15.88 270 bottom
Q1  23.24,53.21 0 bottom
Q2  9.51,22.03 270 bottom
R1  26.67,8.89 270 bottom
R2  29.84,8.89 270 bottom
R3  20.45,4.7 270 top
R4  29.72,51.94 0 bottom
R5  43.69,2.79 270 bottom
R6  42.29,41.66 180 bottom
R7  47.37,34.16 270 bottom
R8  45.85,34.16 270 bottom
R9  25.78,52.96 270 bottom
R10  37.47,52.83 90 bottom
R11  44.7,17.78 0 top
R12  19.43,53.34 270 bottom
R13  12.19,21.97 90 bottom
S1  50.8,72.39 0 bottom
S2  50.8,64.26 0 bottom
S3  40.64,12.06 0 top
S4  49.28,12.06 0 top
S6  7.62,12.06 315 top
TP1  7.62,20.32 0 bottom
U2  21.21,11.43 90 top
U5  43.18,7.87 180 bottom
U$1  [MICROMOD_LOGO_.5]  27.3,20.45 0 top
U$2  [INPUT_AND_DISPLAY0]  29.21,17.78 0 top
U$3  [SFE_LOGO_FLAME_.1]  36.2,20.57 0 top
U$4  [BOOT0]  50.8,60.58 0 bottom
U$5  [#A#0]  40.64,8 0 top
U$6  [#B#0]  49.28,8 0 top
U$7  [00]  3.94,28.21 0 top
U$8  [50]  3.94,76.09 0 top
U$9  [RESET0]  50.8,68.96 0 bottom
U$10  [MICROMOD_LOGO_.6]  6.46,57.91 90 bottom
U$11  [#MEAS#0]  33.27,12.83 90 bottom
U$12  [#I2C#0]  46.61,31.88 0 bottom
U$13  [PWR0]  44.83,20.83 0 top
U$14  [#BYP#0]  35.56,7.75 0 bottom
U$15  [#SWD#0]  5.46,21.84 90 bottom
U$16  [INPUT_AND_DISPLAY0]  29.21,17.78 0 top
U$17  [INPUT_AND_DISPLAY0]  2.54,53.61 90 bottom
U$18  [#5V#0]  55.37,12.7 0 bottom
U$19  [#PWR#0]  46.1,15.88 0 bottom
U$20  [#3V3_CTRL#0]  50.16,7.49 0 bottom
U$21  [#PWM1#0]  16.76,36.58 90 bottom
U$22  [#A0#0]  55.37,33.02 0 top
U$23  [#A0#0]  51.94,33.02 0 bottom
U$24  [#A1#0]  55.37,30.48 0 top
U$25  [#A1#0]  52.2,30.48 0 bottom
U$26  [#TX1#0]  55.37,27.94 0 top
U$27  [#TX1#0]  51.18,27.94 0 bottom
U$28  [#3V3#0]  55.37,17.78 0 bottom
U$29  [#GND#0]  55.37,15.24 0 bottom
U$30  [#GND#0]  50.93,15.24 0 top
U$31  [#3V3#0]  50.93,17.78 0 top
U$32  [#RX1#0]  55.37,25.4 0 top
U$33  [#RX1#0]  51.31,25.4 0 bottom
U$34  [#CAN#RX#0]  55.37,20.32 0 top
U$35  [#CAN#RX#0]  48.01,20.32 0 bottom
U$36  [#CAN#TX#0]  55.37,22.86 0 top
U$37  [#CAN#TX#0]  47.88,22.86 0 bottom
U$38  [#5V#0]  52.07,12.7 0 top

### Tracks (layer width: path | path; a pad name or v marks a point on that pad's centre or on a via)
3.3V  (via drill 0.38)
  Top 0.203: R3.2 21.12,3.85 21.34,4.06 21.34,5.33 21.55,5.55 C12.1
  Top 0.406: U2.1 22.23,7.62 | 22.23,7.62 22.23,9.27 J4.2 | C12.1 22.23,7.62
  Top 0.61: D3.P4 7.24,35.39 | 7.24,65.87 7.24,72.9 6.65,73.49 D8.P4 | 7.24,35.39 v7.24,40.51 7.24,43.01 | 7.24,43.01 v7.24,49.66 | v7.24,49.66 7.24,50.63 D5.P4 | v7.24,49.66 7.24,58.25 | 7.24,58.25 7.24,65.87 | D7.P4 7.24,65.87 | D6.P4 7.24,58.25 | D4.P4 7.24,43.01 | v33.73,61.21 30.17,61.21 28.83,59.87 v28.83,57.53 | v36.7,23.5 36.7,20.95 | 7.24,35.39 7.24,26.04 8.89,24.38 v14.73,24.38 19.43,24.38 v20.19,23.62 20.32,23.5 28.83,23.5 30.61,21.72 30.61,16.89 31.62,15.88 34.92,15.88 | v41.15,23.37 41.15,22.1 40.01,20.95 36.7,20.95 | MEAS.4 34.92,15.88 | 36.7,20.95 36.7,16.38 36.2,15.88 34.92,15.88
  Bottom 0.203: 37.72,61.21 38.23,60.71 J5.38 38.23,55.62 37.47,54.86 R10.2 | J5.29 v33.73,61.21 | J5.31 34.73,61.21 | J1.2 19.57,23.99 19.94,23.62 v20.19,23.62 | J1.74 37.58,24.11 36.96,23.5 v36.7,23.5 | I2C.2 46.61,28.96 46.1,28.45 41.15,28.45
  Bottom 0.305: MEAS.2 MEAS.4
  Bottom 0.406: J4.2 21.46,8.51 15.62,8.51 14.73,9.4 14.73,16.64 | 14.73,16.64 v14.73,24.38 | J7.1 2.67,17.53 3.56,16.64 14.73,16.64 | Q1.2 22.29,49.66
  Bottom 0.61: MEAS.4 35.34,13.8 C5.1 C4.1 C3.1 46.74,13.8 | v28.83,57.53 28.87,57.53 C7.1 R4.2 28.87,50.59 27.94,49.66 22.29,49.66 v7.24,49.66 | v33.73,61.21 34.73,61.21 37.72,61.21 | J2.VCC 52.63,52.78 53,52.41 53,46.39 49.78,43.18 48.26,43.18 | v41.15,23.37 41.15,28.45 41.15,38.61 43.14,40.6 R6.2 C6.1 48.26,43.18 | J6.2 49.16,38.98 48.26,39.88 48.26,43.18 | 46.74,13.8 49.11,13.8 53.09,17.78 J8.3 | PWR.2 46.74,13.8 | LS1.+ 7.3,40.58 v7.24,40.51
3.3V_EN  (via drill 0.38)
  Top 0.203: v19.68,26.8 19.68,25.78 20.83,24.64 32,24.64 33.27,25.91 v33.27,26.92 | v49.53,12.06 49.53,22.48 45.09,26.92 v39.5,26.92
  Bottom 0.203: J1.4 20.07,26.41 v19.68,26.8 | v49.53,12.06 49.53,12.04 49.05,11.56 3V3_EN.1 | v33.27,26.92 v39.5,26.92
!BOOT  (via drill 0.38)
  Top 0.203: v25.65,25.78 30.73,25.78 32.26,27.3 32.26,32.13 32.77,32.64 47.62,32.64 49.53,34.54 49.53,61.85 v50.04,62.36
  Bottom 0.203: S2.3 v50.04,62.36 S2.4 | v25.65,25.78 25.53,25.65 25.53,24.08 21.82,20.38 J1.11
!DISP_BL  (via drill 0.38)
  Top 0.203: v24.26,50.93 28.7,50.93 31.5,48.13 31.5,38.23 30.86,37.59 28.07,37.59 26.67,36.2 v26.67,29.72
  Bottom 0.203: v26.67,29.72 27.07,29.31 J1.32 | v24.26,50.93 24.19,50.99 Q1.1 24.3,52.11 R9.2
!DISP_CS  (via drill 0.38)
  Top 0.203: v35.05,54.1 35.05,52.7 34.29,51.94 v31.75,51.94
  Bottom 0.203: J1.10 21.57,33.01 24.64,36.07 31.62,36.07 32.51,36.96 32.51,51.18 v31.75,51.94 R4.1 | v35.05,54.1 35.23,54.27 J5.32
!DISP_RST  (via drill 0.38)
  Top 0.203: v37.34,49.4 36.32,50.42 34.29,50.42 32.51,48.64 32.51,37.85 31.5,36.83 29.34,36.83 28.57,36.07 28.57,30.48 29.21,29.84 v30.35,29.84
  Bottom 0.203: J5.34 36.23,52.42 36.66,51.98 R10.1 37.47,49.53 v37.34,49.4 | v30.35,29.84 31.24,28.96 31.24,27.56 30.07,26.39 J1.44
!INT  (via drill 0.38)
  Top 0.203: v25.77,13.93 25.73,13.97 U2.6
  Bottom 0.203: J1.16 23.07,23.2 20.45,20.57 17.4,20.57 16.51,19.68 16.51,16 17.14,15.37 20.7,15.37 21.21,14.86 21.21,13.97 21.63,13.55 25.13,13.55 25.51,13.93 v25.77,13.93
!RESET  (via drill 0.38)
  Top 0.203: v50.8,70.48 48.64,68.33 48.64,35.05 46.99,33.4 32.38,33.4 31.5,32.51 31.5,27.81 30.61,26.92 21.21,26.92 v20.83,26.54 | v25.78,11.43 U2.4 23.24,11.43 22.73,10.92 21.97,10.92 21.21,10.16 21.21,7.37 20.45,6.6 R3.1 19.09,5.55 v19.05,5.59
  Bottom 0.203: J1.6 20.57,26.29 v20.83,26.54 20.83,27.3 20.19,27.94 18.8,27.94 17.78,26.92 3.94,26.92 | J7.10 3.94,26.92 | S1.4 v50.8,70.48 S1.3 | v25.78,11.43 25.78,12.32 25.15,12.95 20.83,12.95 19.94,13.84 J4.5 | v19.05,5.59 4.57,5.59 1.27,8.89 1.27,26.16 2.03,26.92 3.94,26.92
!SD_CS  (via drill 0.38)
  Top 0.203: v32.38,20.19 32.38,23.14 33.92,24.68 33.92,28.59 34.94,29.6 36.94,29.6 v37.34,29.21
  Bottom 0.203: J2.CS 46.26,50.58 45.72,50.04 45.72,47.88 43.34,45.5 37.88,45.5 37.34,44.96 37.34,41.66 | J1.55 32.75,17.66 32.75,18.48 32.38,18.84 v32.38,20.19 | R6.1 37.34,41.66 | 37.34,41.66 v37.34,29.21
A0  (via drill 0.38)
  Top 0.203: v33.4,31.37 54.23,31.37 J8.9
  Bottom 0.203: J1.34 27.57,30.88 28.7,32 32.77,32 v33.4,31.37
A1  (via drill 0.38)
  Top 0.203: v33.4,29.84 34.04,30.48 J8.8
  Bottom 0.203: J1.38 28.57,30.23 29.34,30.99 31.5,30.99 32.64,29.84 v33.4,29.84
BTN_A
  Top 0.203: U2.2 24.77,8.89 25.4,9.53 36.2,9.53 36.83,10.16 S3.3
BTN_B
  Top 0.203: U2.3 24.77,10.16 24.9,10.03 35.69,10.03 36.96,11.3 44.45,11.3 45.59,10.16 S4.3
BTN_CENTER
  Top 0.203: U2.10 13.59,12.7 13.34,12.95 13.34,15.37 11.05,17.65 5.84,17.65 4.45,16.26 4.45,15.24 S6.CTR
BTN_DOWN
  Top 0.203: U2.13 15.49,8.89 13.84,7.24 10.47,7.24 S6.D
BTN_LEFT
  Top 0.203: U2.5 25.78,12.7 26.54,13.46 26.54,16 25.02,17.53 11.81,17.53 11.3,18.03 5.08,18.03 3.56,16.51 3.56,14.15 S6.C
BTN_RIGHT
  Top 0.203: U2.12 15.24,10.16 14.35,9.27 12.39,9.27 S6.B
BTN_UP
  Top 0.203: U2.11 13.21,11.43 12.7,11.94 12.7,15.37 10.79,17.27 6.22,17.27 5.46,16.51 5.46,16.2 S6.A
BUZZER  (via drill 0.38)
  Top 0.203: v28.96,20.19 27.64,21.51 13.89,21.51 v13.46,21.08
  Bottom 0.203: v28.96,20.19 30.1,20.19 30.82,19.47 J1.47 | R13.1 13.42,21.12 v13.46,21.08
CAN-RX
  Bottom 0.203: J1.41 29.32,16.27 29.97,15.62 40.89,15.62 42.04,16.76 42.04,18.8 43.37,20.13 43.56,20.32 J8.4
CAN-TX
  Bottom 0.203: J1.43 29.82,16.4 30.23,16 40.64,16 41.66,17.02 41.66,19.05 43.56,20.95 53.98,20.95 J8.5
DISP_D/!C  (via drill 0.38)
  Top 0.203: v34.16,55.5 v32.13,55.5
  Bottom 0.203: J1.18 23.57,31.32 25.27,33.02 32.26,33.02 33.27,34.04 33.27,52.2 32.13,53.34 v32.13,55.5 | J5.30 34.23,55.56 v34.16,55.5
ENABLE
  Bottom 0.203: 3V3_EN.2 45.34,5.71 | 45.34,5.71 44.2,5.71 44.16,5.71 | 44.16,5.71 43.94,5.71 43.69,5.46 R5.1 | D1.C 45.34,5.71 | U5.5 44.16,5.71
GND  (via drill 0.38)
  Bottom 0.203: 21.23,60.96 19.73,60.96 J5.1 19.73,58.67 21.23,58.67 | 21.23,60.96 21.73,60.96 | 21.73,60.96 22.23,60.96 | J5.7 | 22.23,60.96 J5.6 22.23,58.67 | 21.73,60.96 J5.5 21.72,59.9 21.72,58.67 | 21.23,60.96 J5.4 21.23,58.67 | J5.7 22.73,60.96 | 22.23,60.96 22.73,60.96 | 22.73,60.96 24.73,60.96 | 24.73,60.96 25.23,60.96 | 25.23,60.96 25.73,60.96 | 25.73,60.96 26.23,60.96 | 26.23,60.96 26.73,60.96 | 26.73,60.96 27.23,60.96 | 27.23,60.96 27.73,60.96 | 27.73,60.96 28.23,60.96 | 28.23,60.96 28.73,60.96 | 28.73,60.96 29.23,60.96 | 29.23,60.96 29.73,60.96 | 29.73,60.96 30.23,60.96 | 30.23,60.96 30.73,60.96 | 30.73,60.96 31.23,60.96 | 31.23,60.96 31.73,60.96 | 31.73,60.96 32.23,60.96 | 32.23,60.96 32.73,60.96 J5.27 32.73,58.67 32.23,58.67 | 25.23,58.67 24.73,58.67 J5.11 24.73,60.96 | 25.23,58.67 25.73,58.67 | 25.73,58.67 26.23,58.67 | 26.23,58.67 26.73,58.67 | 26.73,58.67 27.23,58.67 | 27.23,58.67 27.73,58.67 | 27.73,58.67 28.23,58.67 | 28.23,58.67 28.73,58.67 | 28.73,58.67 29.23,58.67 | 29.23,58.67 29.73,58.67 | 29.73,58.67 30.23,58.67 | 30.23,58.67 30.73,58.67 | 30.73,58.67 31.23,58.67 | 31.23,58.67 31.73,58.67 | 31.73,58.67 32.23,58.67 | 25.23,58.67 J5.12 25.23,60.96 | 25.73,58.67 J5.13 25.73,60.96 | 26.23,58.67 J5.14 26.23,60.96 | 26.73,58.67 J5.15 26.73,60.96 | 27.23,58.67 J5.16 27.23,60.96 | 27.73,58.67 J5.17 27.73,60.96 | 28.23,58.67 J5.18 28.23,60.96 | 28.73,58.67 J5.19 28.73,60.96 | 29.23,58.67 J5.20 29.23,60.96 | 29.73,58.67 J5.21 29.73,60.96 | 30.23,58.67 J5.22 30.23,60.96 | 30.73,58.67 J5.23 30.73,60.96 | 31.23,58.67 J5.24 31.23,60.96 | 31.73,58.67 J5.25 31.73,60.96 | 32.23,58.67 J5.26 32.23,60.96 | 39.23,58.55 J5.40 39.23,61.09 | J5.7 22.73,58.67 22.23,58.67
  Bottom 0.203: 22.23,58.67 21.72,58.67 | 21.72,58.67 21.23,58.67
  Bottom 0.305: v32.77,7.11 32.26,7.11 31.8,6.65 J3.GND
  other vias: 25.53,7.11 11.56,8.26 45.85,11.94 37.59,12.7 29.46,11.81 17.14,7.62 19.56,19.18 41.15,0.76 46.74,2.79 43.18,7.87 27.94,22.23 17.4,16.26 26.67,19.43 37.59,19.18 28.19,15.88 44.96,7.87 41.4,7.87 53.34,54.99 40.01,43.18 48.39,19.3
  pour Bottom (isolate 0.178, rank 2): 0,0 0,82.55 57.15,82.55 57.15,0
  pour Top (isolate 0.178, rank 2): 0,0 0,82.55 57.15,82.55 57.15,0
LED_CLK  (via drill 0.38)
  Top 0.203: v3.68,29.35 3.81,29.48 D3.P2 | v29.46,28.45 21.08,28.45 20.45,29.08 v20.45,29.72
  Bottom 0.203: J1.40 29.07,28.06 v29.46,28.45 | v20.45,29.72 4.06,29.72 3.7,29.35 v3.68,29.35
LED_DATA  (via drill 0.38)
  Top 0.203: v30.35,27.95 30.09,27.69 20.7,27.69 19.81,28.57 v17.91,28.57
  Top 0.254: D3.P1 2.06,29.2 v2.16,29.1
  Bottom 0.203: J1.42 29.57,27.18 v30.35,27.95 | v17.91,28.57 17.65,28.32 2.94,28.32 v2.16,29.1
MISO_ATTINY
  Top 0.203: J4.1 19.94,10.41 20.83,11.3 20.83,15.11 20.57,15.37 19.43,15.37 19.3,15.24 U2.8
N$1
  Bottom 0.203: R7.2 47.37,32 47.65,31.73 I2C.3
N$2
  Bottom 0.203: R8.2 45.85,32 45.57,31.73 I2C.1
N$3
  Bottom 0.203: J5.8 23.23,56.88 22.86,56.52 19.81,56.52 19.43,56.13 R12.1
N$4
  Bottom 0.203: R12.2 20.95,51.94 21.21,52.2 21.21,53.98 21.55,54.31 Q1.3
N$5  (via drill 0.38)
  Top 0.203: v11.05,25.65 v11.05,35.05
  Bottom 0.203: Q2.3 8.41,25.21 8.86,25.65 v11.05,25.65 | v11.05,35.05 LS1.-
N$6
  Bottom 0.203: Q2.1 12.03,22.98 R13.2
N$11
  Top 0.203: D3.P5 D4.P2
N$14
  Top 0.203: D3.P6 D4.P1
N$19
  Bottom 0.203: J3.A5 29.82,6.71 29.84,6.73 R2.2
N$20
  Bottom 0.203: J3.B5 26.82,6.83 26.67,6.99 R1.2
N$21  (via drill 0.38)
  Top 0.203: R11.2 46.88,17.78 46.88,17.77 v46.86,17.75
  Bottom 0.203: v46.86,17.75 46.74,17.63 PWR.1
N$22
  Top 0.203: D2.A 43.83,17.81 R11.1
N$23
  Bottom 0.203: 42.2,9.91 U5.1
  Bottom 0.305: MEAS.3 MEAS.1
  Bottom 0.61: MEAS.3 36.07,10.54 41.57,10.54 42.2,9.91
N$24
  Top 0.203: D4.P5 D5.P2
N$25
  Top 0.203: D4.P6 D5.P1
N$26
  Top 0.203: D5.P5 D6.P2
N$27
  Top 0.203: D5.P6 D6.P1
N$28
  Top 0.203: D6.P5 D7.P2
N$29
  Top 0.203: D6.P6 D7.P1
N$30
  Top 0.203: D7.P5 D8.P2
N$31
  Top 0.203: D7.P6 D8.P1
RX1
  Bottom 0.203: J1.19 23.82,20.02 24.77,20.95 42.04,20.95 43.05,21.97 43.05,24.77 43.69,25.4 J8.6
SCL  (via drill 0.38)
  Top 0.203: U2.9 19.18,13.97 19.94,13.21 J4.3 | v31.88,34.42 46.23,34.42 47.37,35.56 v47.37,36.32
  Bottom 0.178: 51.28,36.96 47.62,36.96 47.37,36.7 v47.37,36.32 R7.1
  Bottom 0.203: J4.3 19.91,12.09 16.74,12.09 16.13,12.7 16.13,19.94 17.27,21.08 20.32,21.08 22.57,23.34 J1.14 22.57,31.59 24.77,33.78 31.24,33.78 v31.88,34.42 | J6.4 51.28,36.96
SDA  (via drill 0.38)
  Top 0.203: J4.4 21.97,12.06 21.72,12.32 21.72,14.99 22.1,15.37 23.5,15.37 23.62,15.24 U2.7 | v45.85,36.32 45.47,35.94 31.62,35.94 v30.61,34.92
  Bottom 0.178: J6.3 46.87,37.98 45.85,36.96 v45.85,36.32 R8.1
  Bottom 0.203: J4.4 21.49,11.07 16.48,11.07 15.75,11.81 15.75,20.19 17.13,21.57 20.05,21.57 22.07,23.6 J1.12 22.07,32.23 24.77,34.92 v30.61,34.92
SPI_CIPO  (via drill 0.38)
  Top 0.203: v36.58,44.7 35.69,44.7 34.67,45.72 v34.67,48.26 | v36.45,28.07 36.45,24.79 35.05,23.39 v35.05,19.43
  Bottom 0.203: J5.28 33.23,54.15 34.16,53.21 34.16,48.77 v34.67,48.26 42.16,48.26 43.31,49.4 43.31,55.12 44.27,56.08 J2.DO | J1.61 34.33,18.7 v35.05,19.43 | v36.58,44.7 36.45,44.58 v36.45,28.07
SPI_COPI  (via drill 0.38)
  Top 0.203: v38.73,50.29 v38.73,46.23 | v34.16,20.19 34.16,23.24 35.56,24.64 v35.56,28.57
  Bottom 0.203: v35.56,28.57 35.56,45.21 36.58,46.23 v38.73,46.23 38.74,46.22 42.92,46.22 44.86,48.16 44.86,50.83 45.71,51.68 J2.DI | v38.73,50.29 38.73,50.3 J5.39 | J1.59 33.9,17.66 33.9,18.81 34.16,19.08 v34.16,20.19
SPI_SCK  (via drill 0.38)
  Top 0.203: v35.73,47.02 35.73,49.49 v35.69,49.53 | v33.27,19.43 33.27,23.11 34.67,24.51 v34.67,28.07
  Bottom 0.203: v35.69,49.53 35.73,49.57 J5.33 | J2.SCLK 45.12,53.88 44.1,52.86 44.1,48.67 42.45,47.02 v35.73,47.02 34.67,45.97 v34.67,28.07 | J1.57 33.33,19.38 v33.27,19.43
SWDCK  (via drill 0.38)
  Top 0.203: v24.51,19.3 23.5,18.29 12.32,18.29 10.03,20.57 J7.4
  Bottom 0.203: J1.21 24.32,19.12 v24.51,19.3 | TP1.P$1 7.37,20.57 J7.4
SWDIO  (via drill 0.38)
  Top 0.203: v25.65,18.92 25.65,18.9 24.66,17.91 12.06,17.91 10.67,19.3 J7.2
  Bottom 0.203: J1.23 24.82,18.48 25.27,18.92 v25.65,18.92
TX1
  Bottom 0.203: J1.17 23.32,20.05 24.73,21.46 41.78,21.46 42.55,22.23 42.55,25.15 43.31,25.91 53.85,25.91 J8.7
USB_D+
  Bottom 0.203: J1.3 19.82,16.37 20.34,15.85 25.81,15.85 27.82,13.83 J3.B6 27.81,6 27.81,5.21 28.07,4.95 28.57,4.95 28.82,5.2 J3.A6
USB_D-
  Bottom 0.203: J3.A7 28.32,7.24 | 28.32,7.24 28.32,13.97 25.96,16.33 20.5,16.33 20.32,16.5 J1.5 | J3.B7 29.32,7 29.08,7.24 28.32,7.24
V_USB  (via drill 0.38)
  Top 0.61: J8.1 55.88,9.91 51.14,5.17 43.97,5.17 42.1,3.3 30.35,3.3 v29.46,4.19
  Bottom 0.406: J3.VBUS1 31.02,5.46 30.76,5.2 30.76,4.47 30.48,4.19 | J3.VBUS2 26.12,5.46 26.39,5.2 26.39,4.47 26.67,4.19
  Bottom 0.508: J3.VBUS1 31.02,6.77 32.26,8 34.92,8 35.79,7.14 BYP.1 35.81,5.94 35.81,4.57 35.71,4.47 F2.1 | 30.48,4.19 v29.46,4.19 26.67,4.19
VIN  (via drill 0.38)
  Top 0.305: v29.72,13.72 29.21,14.22 29.21,18.16 26.8,20.57 21.72,20.57 v20.7,19.56
  Bottom 0.203: R5.2 43.61,1.94 C1.1
  Bottom 0.305: J1.9 21.32,19.29 21.06,19.56 v20.7,19.56 | BYP.2 36.7,6.07 36.7,8 35.43,9.27 32.77,9.27 31.11,10.92 31.11,12.32 v29.72,13.72
  pour Bottom (isolate 0.305, no thermals): 42.29,6.73 42.29,5.46 42.42,5.33 42.42,3.17 39.37,3.17 39.37,1.27 37.34,1.27 37.34,4.32 36.45,5.21 36.45,7.11 40.64,7.11 41.02,6.73

### Text on the board
Bottom: v11
tDocu: Alex Wende